# Altium schematic sheet tablo tara.SchDoc
size A3
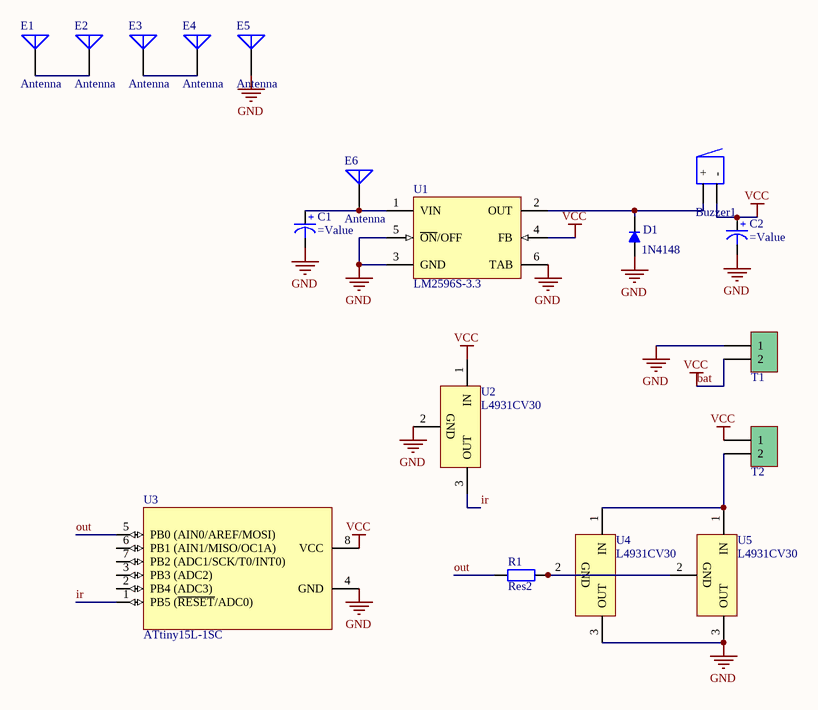
[diagram p0: tablo tara.SchDoc]

## Parts
Buzzer1  Buzzer  [BUZZER]  (value not drawn)
C1  (no value)  [ELEC-CAP-RAD10-20]
C2  (no value)  [ELEC-CAP-RAD10-20]
D1  MODEL: 1N4148  [DO-41]  (hidden comment: MODEL)
E1  Antenna  [PIN1]
E2  Antenna  [PIN1]
E3  Antenna  [PIN1]
E4  Antenna  [PIN1]
E5  Antenna  [PIN1]
E6  Antenna  [PIN1]
R1  Res2  [Res50]
T1  Phoenix terminal  [phoenix terminal 2]  (value not drawn)
T2  Phoenix terminal  [phoenix terminal 2]  (value not drawn)
U1  LM2596S-3.3  [TS5B_N]
U2  L4931CV30  [TO-220A]
U3  ATtiny15L-1SC  [8S2_N]
U4  L4931CV30  [TO-220A]
U5  L4931CV30  [TO-220A]

## Nets
bat: Buzzer1.2(-) C2.2(+) T1.2 T2.1 U1.4(FB) U2.1(IN) U3.8(VCC)  [also labelled VCC]
GND: C1.1(-) C2.1(-) D1.1(A) E5.1(A) T1.1 U1.3(GND) U1.5(~{ON}/OFF) U1.6(TAB) U2.2(GND) U3.4(GND) U4.3(OUT) U5.3(OUT)
ir: U2.3(OUT) U3.1(PB5_(~{RESET}/ADC0))
out: R1.1 U3.5(PB0_(AIN0/AREF/MOSI))
NetBuzzer1_1: Buzzer1.1(+) D1.2(K) U1.2(OUT)
NetC1_2: C1.2(+) E6.1(A) U1.1(VIN)
NetE1_1: E1.1(A) E2.1(A)
NetE3_1: E3.1(A) E4.1(A)
NetR1_2: R1.2 U4.2(GND) U5.2(GND)
NetT2_2: T2.2 U4.1(IN) U5.1(IN)

Not connected (* = marked no-connect by the designer): U3 2(PB4_(ADC3)) 3(PB3_(ADC2)) 6(PB1_(AIN1/MISO/OC1A)) 7(PB2_(ADC1/SCK/T0/INT0))

## Library data of the parts
Buzzer1 = Buzzer: Designer: Seyed Mohsen Ghasemain; ComponentLinkURL: www.picpars.com
C1 C2 = Capacitor Electrolytic: Electrolytic Capacitor
D1 = Diode
E1-E6 = Antenna: Generic Antenna; Published: 24-Mar-1999; LatestRevisionDate: 17-Jul-2002; LatestRevisionNote: Re-released for DXP Platform.; PackageReference: PIN1; Publisher: Altium Limited
R1 = Res2: Resistor; Published: 8-Jun-2000; LatestRevisionDate: 17-Jul-2002; LatestRevisionNote: Re-released for DXP Platform.; PackageReference: AXIAL-0.4; Publisher: Altium Limited; PackageDescription: Axial Device, Thru-Hole; 2 Leads; 0.4 in Pin Spacing
T1 T2 = Phoenix terminal 2: Terminal 2 Pin; Designer: Seyed Mohsen Ghasemain; E-mail: picpars@gmail.com; ComponentLinkURL: www.picpars.com
U1 = LM2596S-3.3: SIMPLE SWITCHER Power Converter 150 KHz 3A Step-Down Voltage Regulator; Manufacturer: National Semiconductor; PackageTopMarking: NSUZXYTT*LM2596S*-3.3 P+; PowerWise: N; FirstPublished: 4-Dec-2008; DatasheetVersion: May-2002; PackageVersion: revD, Apr-2005; PackageReference: TS5B; Publisher: Altium Limited; PackageDescription: TO-263, Molded, .400 x .390 x .180in, 5 Lead, .067in Pitch, Surface Mount; CompType: Switcher; PartNumber: LM2596S-3.3; RoHS: O; PinCount: 5; DigiKeyPartNumber: LM2596S-3.3-ND; Code_JEDEC: MO-169-AB; ComponentLink1Description: LM2596 Datasheet; ComponentLink1URL: http://www.national.com/ds/LM/LM2596.pdf; ComponentLink2Description: LM2596 Web Page; ComponentLink2URL: http://www.national.com/pf/LM/LM2596.html; ComponentLink3Description: TS5B Package Page; ComponentLink3URL: http://www.national.com/packaging/folders/ts5b.html
U2 U4 U5 = L4931CV30: 250mA, Very Low Drop ( 0.4V) Voltage Regulator; Published: 24-Aug-2001; LatestRevisionDate: 06-Jun-2005; LatestRevisionNote: PCB Pin sequence re-ordered.; DatasheetVersion: Apr-1999; PackageVersion: Jul-2004; PackageReference: TO-220A; Publisher: Altium Limited; PackageDescription: TO, Thru-Hole, Vertical, Heatsink Mounted; 3 In-Line Leads; Pitch 2.54 mm; ComponentLink1Description: Manufacturer Link; ComponentLink1URL: http://www.st.com/; ComponentLink2Description: Datasheet; ComponentLink2URL: http://www.st.com/stonline/products/literature/ds/4340/l4931abxx15.pdf
U3 = ATtiny15L-1SC: 8-Bit AVR Microcontroller with 1K Byte of Flash Memory; Published: 17-Sep-2003; LatestRevisionDate: 16-Oct-2006; LatestRevisionNote: IPC-7351 Footprint Added.; DatasheetVersion: 1187E-AVR-06/02; PackageVersion: revF, Apr-2008; PackageReference: 8S2; Publisher: Altium Limited; PackageDescription: 8-Lead, 0.208" Body, Plastic Small Outline Package (EIAJ); Supplier 1: Digi-Key; Supplier Part Number 1: ATTINY15L-1SC-ND; Supplier 2: Mouser; Supplier Part Number 2: 556-ATTINY15L1SC; ComponentLink1Description: Datasheet; ComponentLink1URL: http://www.atmel.com/dyn/resources/prod_documents/doc1187.pdf; ComponentLink2Description: Atmel.com Home; ComponentLink2URL: http://www.atmel.com